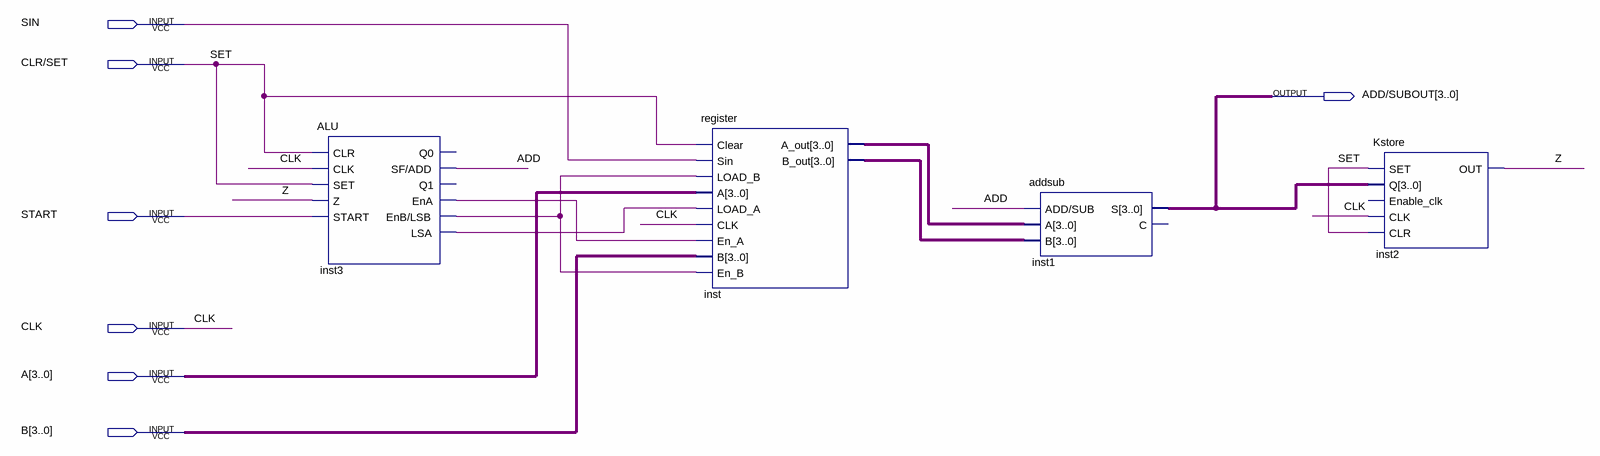
[diagram p0: schematic sheet]
// Quartus schematic datapath.bdf as structural Verilog: 4 symbols, 7 pins
module datapath (
  input  SIN,
  input  \CLR/SET ,
  input  START,
  input  CLK,
  input  [3:0] A,
  input  [3:0] B,
  output [3:0] \ADD/SUBOUT 
);

  wire ADD, inst3_ena, inst3_enb_lsb, inst3_lsa, Z;
  wire [3:0] inst_a_out, inst_b_out;

  ALU inst3 (
    .CLR(\CLR/SET ), .CLK(CLK), .SET(\CLR/SET ), .Z(Z), .START(START), .\SF/ADD (ADD), .EnA(inst3_ena),
    .\EnB/LSB (inst3_enb_lsb), .LSA(inst3_lsa));  // open: Q0, Q1
  register inst (
    .Clear(\CLR/SET ), .Sin(SIN), .LOAD_B(inst3_enb_lsb), .A(A), .LOAD_A(inst3_lsa), .CLK(CLK),
    .En_A(inst3_ena), .B(B), .En_B(inst3_enb_lsb), .A_out(inst_a_out), .B_out(inst_b_out));
  addsub inst1 (.\ADD/SUB (ADD), .A(inst_a_out), .B(inst_b_out), .S(\ADD/SUBOUT ));  // open: C
  Kstore inst2 (.SET(\CLR/SET ), .Q(\ADD/SUBOUT ), .CLK(CLK), .CLR(\CLR/SET ), .OUT(Z));  // open: Enable_clk

  // Other names for the same wires on the sheet: SET = \CLR/SET 
endmodule
